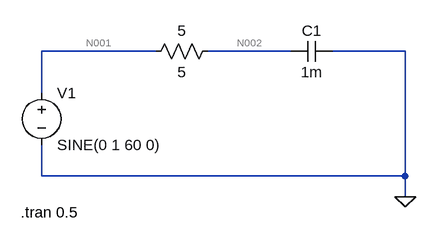
[diagram p0: schematic rc-seriese.asc]
rc-seriese.asc, the LTspice schematic file:
Version 4.1
SHEET 1 880 680
WIRE -80 32 -256 32
WIRE 128 32 0 32
WIRE 304 32 192 32
WIRE -256 96 -256 32
WIRE -256 224 -256 176
WIRE 304 224 304 32
WIRE 304 224 -256 224
WIRE 304 256 304 224
FLAG 304 256 0
SYMBOL res -96 48 R270
WINDOW 0 32 56 VTop 2
WINDOW 3 0 56 VBottom 2
SYMATTR InstName 5
SYMATTR Value 5
SYMBOL cap 192 16 R90
WINDOW 0 0 32 VBottom 2
WINDOW 3 32 32 VTop 2
SYMATTR InstName C1
SYMATTR Value 1m
SYMBOL voltage -256 80 R0
WINDOW 123 0 0 Left 0
WINDOW 39 0 0 Left 0
SYMATTR InstName V1
SYMATTR Value SINE(0 1 60 0)
TEXT -288 280 Left 2 !.tran 0.5

The netlist it stands for:
* rc-seriese.asc
R§5 N001 N002 5
C1 0 N002 1m
V1 N001 0 SINE(0 1 60 0)
.tran 0.5
.backanno
.end

* Results of the author's LTspice run, read from the files saved beside the schematic
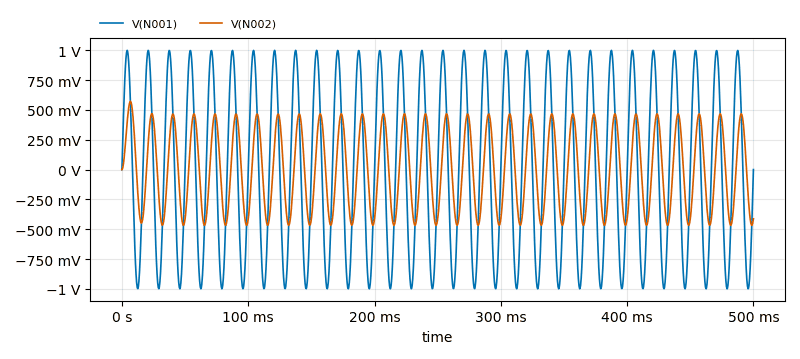
[diagram p1: Transient Analysis of rc-seriese.asc, plotted from the saved traces]
* Transient Analysis, 1 run:
*   V(N001): min -1 V, max 1 V, average 1.433 µV, rms 707.2 mV, last 0 V
*   V(N002): min -467.6 mV, max 571.8 mV, average 4.135 mV, rms 332 mV, last -413.4 mV